# Altium schematic sheet VBAT design.SchDoc
size A; SheetNumber: 2; SheetTotal: 7
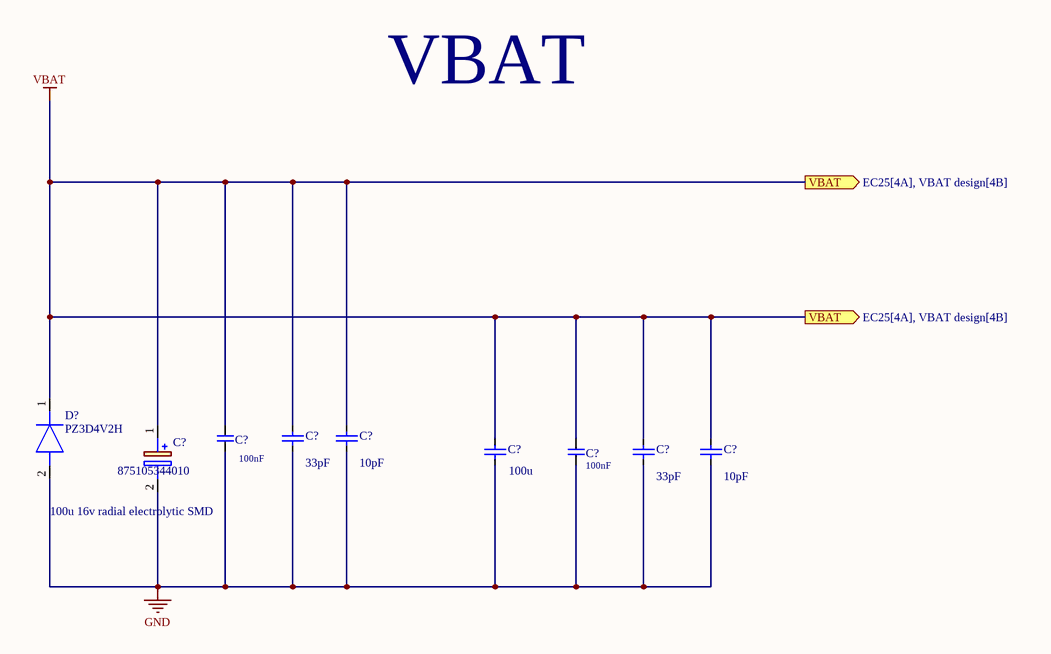
[diagram p0: VBAT design.SchDoc]

## Parts
(Parts that share a designator on the sheet are numbered #1, #2 ... from top to bottom, then left to right.)
C?#1  875105344010  [CAPAE660X580N]
C?#2  value 100nF  [CAPC1005X06N]  (hidden comment: Cap)
C?#3  value 33pF  [CAPC1608X09N]  (hidden comment: C)
C?#4  value 10pF  [CAPC1608X09N]  (hidden comment: C)
C?#5  value 100nF  [CAPC1005X06N]  (hidden comment: Cap)
C?#6  value 100u  [CAPC1608X09N]  (hidden comment: C)
C?#7  value 33pF  [CAPC1608X09N]  (hidden comment: C)
C?#8  value 10pF  [CAPC1608X09N]  (hidden comment: C)
D?  PZ3D4V2H  [PZ3D4V2H]

## Ports
VBAT (out, see EC25[4A], VBAT design[4B])

## Nets
GND: C?#1.2(-) C?#2.2 C?#3.1 C?#4.1 C?#5.2 C?#6.1 C?#7.1 C?#8.1 D?.2(A)
VBAT: C?#1.1(+) C?#2.1 C?#3.2 C?#4.2 C?#5.1 C?#6.2 C?#7.2 C?#8.2 D?.1(K) ; port VBAT

## Notes on the sheet
- VBAT
- 100u 16v radial electrolytic SMD

## Library data of the parts
C?#1 = 875105344010: Capacitor Polarised; Manufacturer_Name: Wurth Elektronik; Datasheet Link: https://katalog.we-online.de/pbs/datasheet/875105344010.pdf; Height: 5.8mm; Manufacturer_Part_Number: 875105344010; Mouser Part Number: 710-875105344010; Mouser Price/Stock: https://www.mouser.co.uk/ProductDetail/Wurth-Elektronik/875105344010?qs=0KOYDY2FL2%2F64TGt8E3UEQ%3D%3D
C?#2 C?#5 = Cap: Capacitor; MPN: GCM155R71H104KE02D; Link: https://jlcpcb.com/partdetail/MurataElectronics-GCM155R71H104KE02D/C85858; Price: 0.0031
D? = PZ3D4V2H: Diode; Manufacturer_Name: Prisemi; Datasheet Link: http://www.prisemi.com/UploadImage/files/Zener/PZ3D4V2H.pdf; Height: 1mm; Manufacturer_Part_Number: PZ3D4V2H
C?#3 C?#4 C?#6-C?#8 = C: MPN: *; Link: *